# Altium schematic sheet SML-230109PCB1__COVER.SchDoc
size A4; DocumentNumber: 1; SheetNumber: 1; SheetTotal: 6
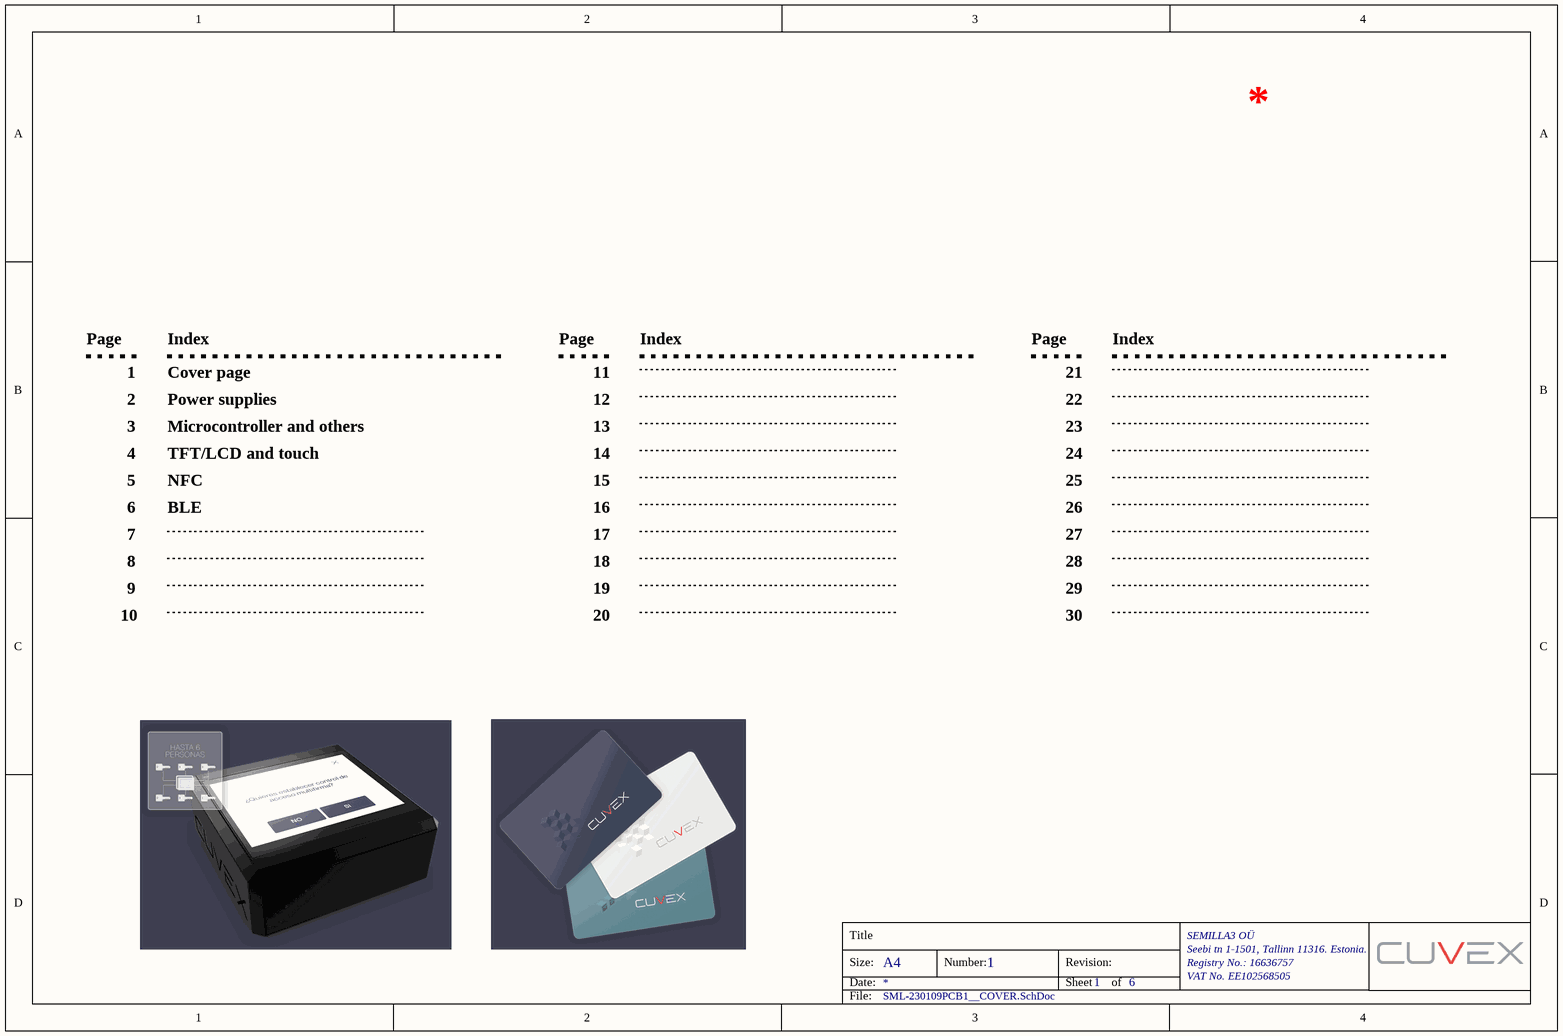
[diagram p0: SML-230109PCB1__COVER.SchDoc]

## Notes on the sheet
- Page
- 1
- Index
- Cover page
- 11
- 21
- 2
- 3
- Power supplies
- Microcontroller and others
- 12
- 13
- 22
- 23
- 4
- 5
- 6
- TFT/LCD and touch
- NFC
- BLE
- 14
- 15
- 16
- 24
- 25
- 26
- 7
- 8
- 17
- 18
- 27
- 28
- 10
- 9
- 19
- 20
- 29
- 30
- Title
- Size:
- Date:
- A4
- Number:
- Revision:
- Sheet
- of
- SEMILLA3 OÜ
- Seebi tn 1-1501, Tallinn 11316. Estonia.
- Registry No.: 16636757
- VAT No. EE102568505
- File: